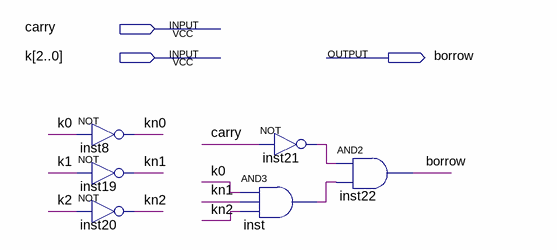
[diagram p0: schematic sheet]
// Quartus schematic borrow_check.bdf as structural Verilog: 6 symbols, 3 pins
module borrow_check (
  input  carry,
  input  [2:0] k,
  output borrow
);

  wire inst21_out, inst_out, kn0, kn1, kn2;

  not inst8 (kn0, k[0]);
  not inst19 (kn1, k[1]);
  not inst20 (kn2, k[2]);
  not inst21 (inst21_out, carry);
  and inst (inst_out, k[0], kn1, kn2);
  and inst22 (borrow, inst21_out, inst_out);
endmodule
